# Altium schematic sheet MCU.SchDoc
size A4; DocumentNumber: 1; SheetNumber: 1; SheetTotal: 4
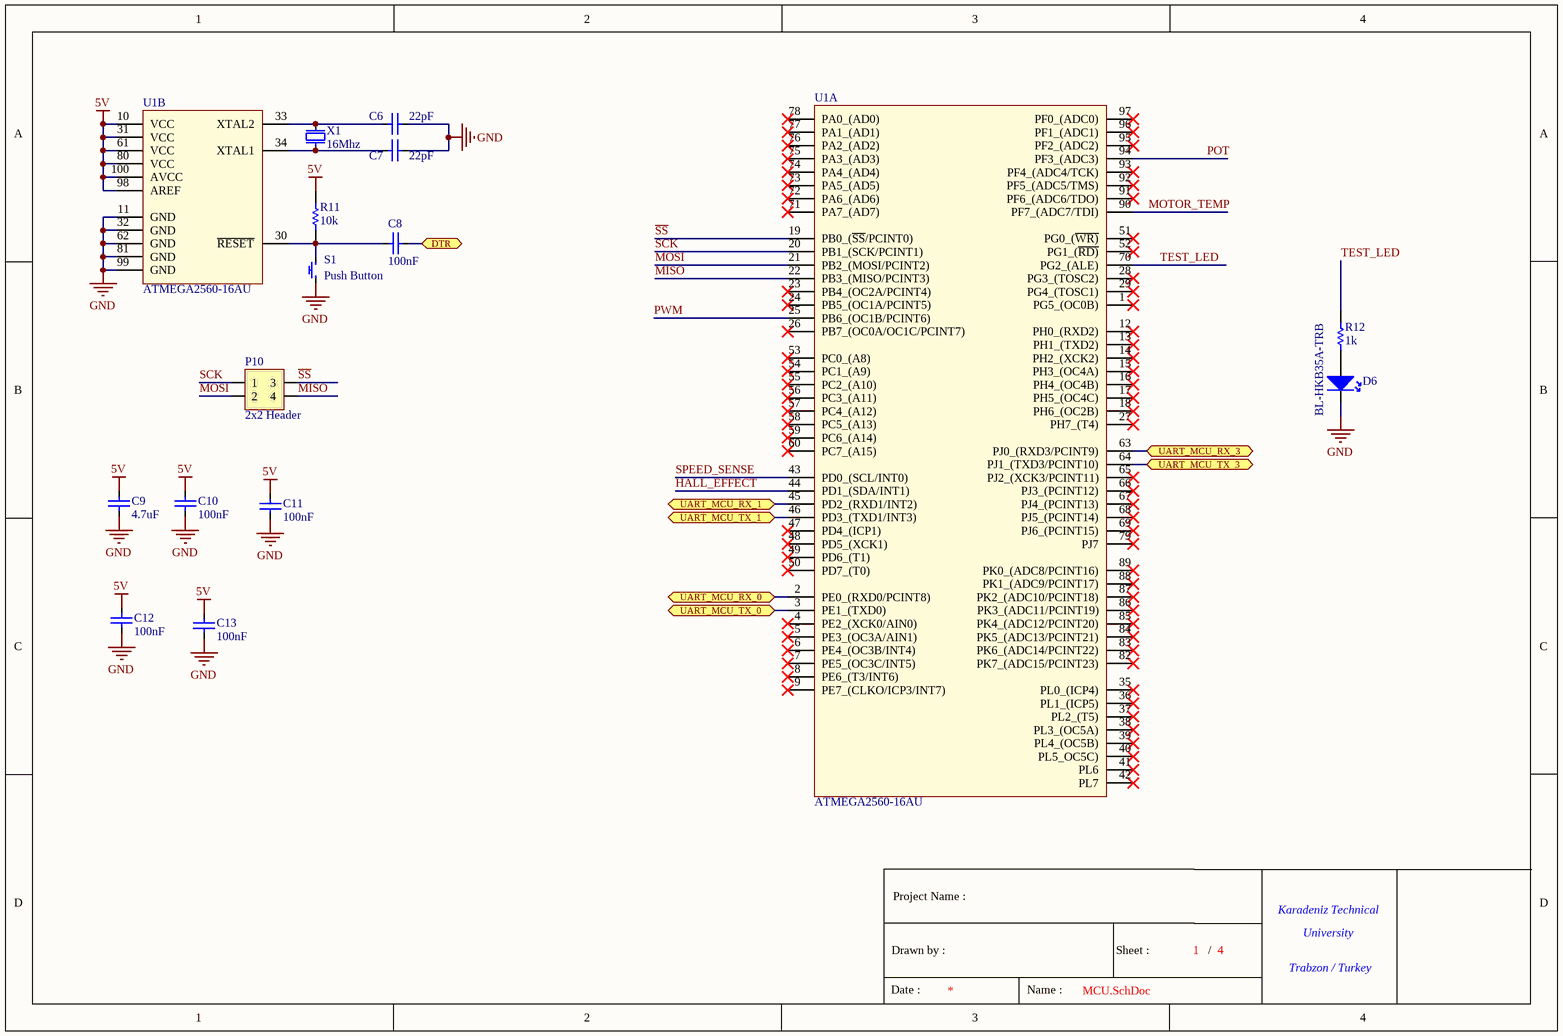
[diagram p0: MCU.SchDoc]

## Parts
?  (no value)  (graphical)
C6  22pF  [CAP-0805]
C7  22pF  [CAP-0805]
C8  100nF  [CAP-0603]
C9  4.7uF  [CAP-0805]
C10  100nF  [CAP-0603]
C11  100nF  [CAP-0603]
C12  100nF  [CAP-0603]
C13  100nF  [CAP-0603]
D6  BL-HKB35A-TRB  [LED-0805]
P10  2x2 Header  [2x2 Header (2.54mm)]
R11  10k  [RES-0603]
R12  1k  [RES-0603]
S1  Push Button  [2.54mm_Push Button]  (no BOM)
U1  ATMEGA2560-16AU  [TQFP-100 Microchip]  (parts A,B of 2)
X1  16Mhz  [OSC-THT (11.5*5.00*3.60)]

## Ports
DTR (bidir), UART_MCU_RX_0 (bidir), UART_MCU_RX_1 (bidir), UART_MCU_RX_3 (bidir), UART_MCU_TX_0 (bidir), UART_MCU_TX_1 (bidir), UART_MCU_TX_3 (bidir)

## Nets
5V: C9.2 C10.2 C11.2 C12.2 C13.2 R11.2 U1.10(VCC) U1.31(VCC) U1.61(VCC) U1.80(VCC) U1.98(AREF) U1.100(AVCC)
GND: C6.1 C7.1 C9.1 C10.1 C11.1 C12.1 C13.1 D6.2(K) S1.1 U1.11(GND) U1.32(GND) U1.62(GND) U1.81(GND) U1.99(GND)
DTR: C8.2 ; port DTR
HALL_EFFECT: U1.44(PD1_(SDA/INT1))
MISO: P10.4 U1.22(PB3_(MISO/PCINT3))
MOSI: P10.2 U1.21(PB2_(MOSI/PCINT2))
MOTOR_TEMP: U1.90(PF7_(ADC7/TDI))
POT: U1.94(PF3_(ADC3))
PWM: U1.25(PB6_(OC1B/PCINT6))
~{SS}: P10.3 U1.19(PB0_(~{SS}/PCINT0))
SCK: P10.1 U1.20(PB1_(SCK/PCINT1))
SPEED_SENSE: U1.43(PD0_(SCL/INT0))
TEST_LED: R12.2 U1.70(PG2_(ALE))
UART_MCU_RX_0: U1.2(PE0_(RXD0/PCINT8)) ; port UART_MCU_RX_0
UART_MCU_RX_1: U1.45(PD2_(RXD1/INT2)) ; port UART_MCU_RX_1
UART_MCU_RX_3: U1.63(PJ0_(RXD3/PCINT9)) ; port UART_MCU_RX_3
UART_MCU_TX_0: U1.3(PE1_(TXD0)) ; port UART_MCU_TX_0
UART_MCU_TX_1: U1.46(PD3_(TXD1/INT3)) ; port UART_MCU_TX_1
UART_MCU_TX_3: U1.64(PJ1_(TXD3/PCINT10)) ; port UART_MCU_TX_3
NetC6_2: C6.2 U1.33(XTAL2) X1.2
NetC7_2: C7.2 U1.34(XTAL1) X1.1
NetC8_1: C8.1 R11.1 S1.2 U1.30(~{RESET})
NetD6_1: D6.1(A) R12.1

Not connected (* = marked no-connect by the designer): U1 1(PG5_(OC0B))* 4(PE2_(XCK0/AIN0))* 5(PE3_(OC3A/AIN1))* 6(PE4_(OC3B/INT4))* 7(PE5_(OC3C/INT5))* 8(PE6_(T3/INT6))* 9(PE7_(CLKO/ICP3/INT7))* 12(PH0_(RXD2))* 13(PH1_(TXD2))* 14(PH2_(XCK2))* 15(PH3_(OC4A))* 16(PH4_(OC4B))* 17(PH5_(OC4C))* 18(PH6_(OC2B))* 23(PB4_(OC2A/PCINT4))* 24(PB5_(OC1A/PCINT5))* 26(PB7_(OC0A/OC1C/PCINT7))* 27(PH7_(T4))* 28(PG3_(TOSC2))* 29(PG4_(TOSC1))* 35(PL0_(ICP4))* 36(PL1_(ICP5))* 37(PL2_(T5))* 38(PL3_(OC5A))* 39(PL4_(OC5B))* 40(PL5_OC5C))* 41(PL6)* 42(PL7)* 47(PD4_(ICP1))* 48(PD5_(XCK1))* 49(PD6_(T1))* 50(PD7_(T0))* 51(PG0_(~{WR)})* 52(PG1_(~{RD)})* 53(PC0_(A8))* 54(PC1_(A9))* 55(PC2_(A10))* 56(PC3_(A11))* 57(PC4_(A12))* 58(PC5_(A13))* 59(PC6_(A14))* 60(PC7_(A15))* 65(PJ2_(XCK3/PCINT11))* 66(PJ3_(PCINT12))* 67(PJ4_(PCINT13))* 68(PJ5_(PCINT14))* 69(PJ6_(PCINT15))* 71(PA7_(AD7))* 72(PA6_(AD6))* 73(PA5_(AD5))* 74(PA4_(AD4))* 75(PA3_(AD3))* 76(PA2_(AD2))* 77(PA1_(AD1))* 78(PA0_(AD0))* 79(PJ7)* 82(PK7_(ADC15/PCINT23))* 83(PK6_(ADC14/PCINT22))* 84(PK5_(ADC13/PCINT21))* 85(PK4_(ADC12/PCINT20))* 86(PK3_(ADC11/PCINT19))* 87(PK2_(ADC10/PCINT18))* 88(PK1_(ADC9/PCINT17))* 89(PK0_(ADC8/PCINT16))* 91(PF6_(ADC6/TDO))* 92(PF5_(ADC5/TMS))* 93(PF4_(ADC4/TCK))* 95(PF2_(ADC2))* 96(PF1_(ADC1))* 97(PF0_(ADC0))*

## Notes on the sheet
- Project Name :
- Karadeniz Technical
- Date :
- Drawn by :
- Name :
- Sheet :
- /
- University
- Trabzon / Turkey

## Library data of the parts
? = Title Block: Standart Title Block
C6 C7 = CL21C220JBANNNC: Manufacturer: Samsung Electro-Mechanics; Temperature Coefficient: C0G; Voltage: 50V; Library Reference: Capacitor; Tolerance: %5; Man Code: CL21C220JBANNNC; Value: 22pF; Footprint: 0805; Component Type: Ceramic Capacitor
C8 C10-C13 = CGA3E2X7R1H104K080AA: Manufacturer: TDK; Temperature Coefficient: X7R; Voltage: 50V; Library Reference: Capacitor; Tolerance: %10; Man Code: CGA3E2X7R1H104K080AA; Value: 100nF; Footprint: 0603; Component Type: Ceramic Capacitor
C9 = C0805C475K3RACAUTO: Manufacturer: Kemet; Temperature Coefficient: X7R; Voltage: 25V; Library Reference: Capacitor; Tolerance: %10; Man Code: C0805C475K3RACAUTO; Value: 4.7uF; Footprint: 0805; Component Type: Ceramic Capacitor
D6 = BL-HKB35A-TRB: Manufacturer: BRIGHT LED; Colour: Yellow; Vf: 2.2V; Library Reference: Miscellaneous; Luminous Intensity: 94mcd; If: 20mA; Lens Transparency: Water Clear; Man Code: BL-HKB35A-TRB; Footprint: 0805; Component Type: Led
P10 = 2x2 Header (2.54mm): Library Reference: Connector; Gender: Male; Contact Number: 4; Number of Row: 2; Mounting Angle: 180; Pitch: 2.54mm; Man Code: 2x2 Header; Component Type: Header; Manufacturer: -; Mating Connector: -; Mounting Style: Through Hole; Current(max): -; Contact Resistance(max): -
R11 = CRCW060310K0FKEA: Manufacturer: Vishay; Tolerance: %1; Power: 0.1W; Library Reference: Resistor; Man Code: CRCW060310K0FKEA; Value: 10k; Footprint: 0603; Component Type: Chip Resistor
R12 = CRCW06031K00FKEAC: Manufacturer: Vishay; Tolerance: %1; Power: 0.1W; Library Reference: Resistor; Man Code: CRCW06031K00FKEAC; Value: 1k; Footprint: 0603; Component Type: Chip Resistor
S1 = Push Button: Library Reference: Other Switches; Component Type: Push Button
U1 = ATMEGA2560-16AU: Manufacturer: Microchip; Library Reference: Integrated_Circuit; Number Of Bits: 8-Bit; Speed: 16Mhz; Program Memory Size: 256KB; Supply Voltage: 4.5V - 5.5V; Component Type: Microcontroller; Man Code: ATMEGA2560-16AU
X1 = AS49S-16M-FC160F3: Manufacturer: ANSEN; Frequency Tolerance: 20ppm; Frequency Stability: 50ppm; Library Reference: Miscellaneous; Capacitance: 16pF; ESR: 30ohm; Man Code: AS49S-16M-FC160F3; Value: 16Mhz; Component Type: Crystal Oscillator; Footprint: THT (11.5*5.00*3.60)